# Altium schematic sheet 88LM Schematic.SchDoc: 8 x 8 Led Multiplexing
size A2; DrawnBy: Zachary Welch; Organization: M5 Makerspace; Revision: 01; SheetNumber: 1; SheetTotal: 1; M5TCID: M5TC-2021-88LM-0A(01); Version: 01; SheetSize: A2; Status: WIP; Designer1: Zachary Welch; Reviewer1: N/A; year: 2021; abbrev: 88LM; URL: N/A; Variant: A; CustomDate: 06 JUNE 2021; Designer2: N/A; Designer3: N/A; Reviewer2: N/A; Reviewer3: N/A
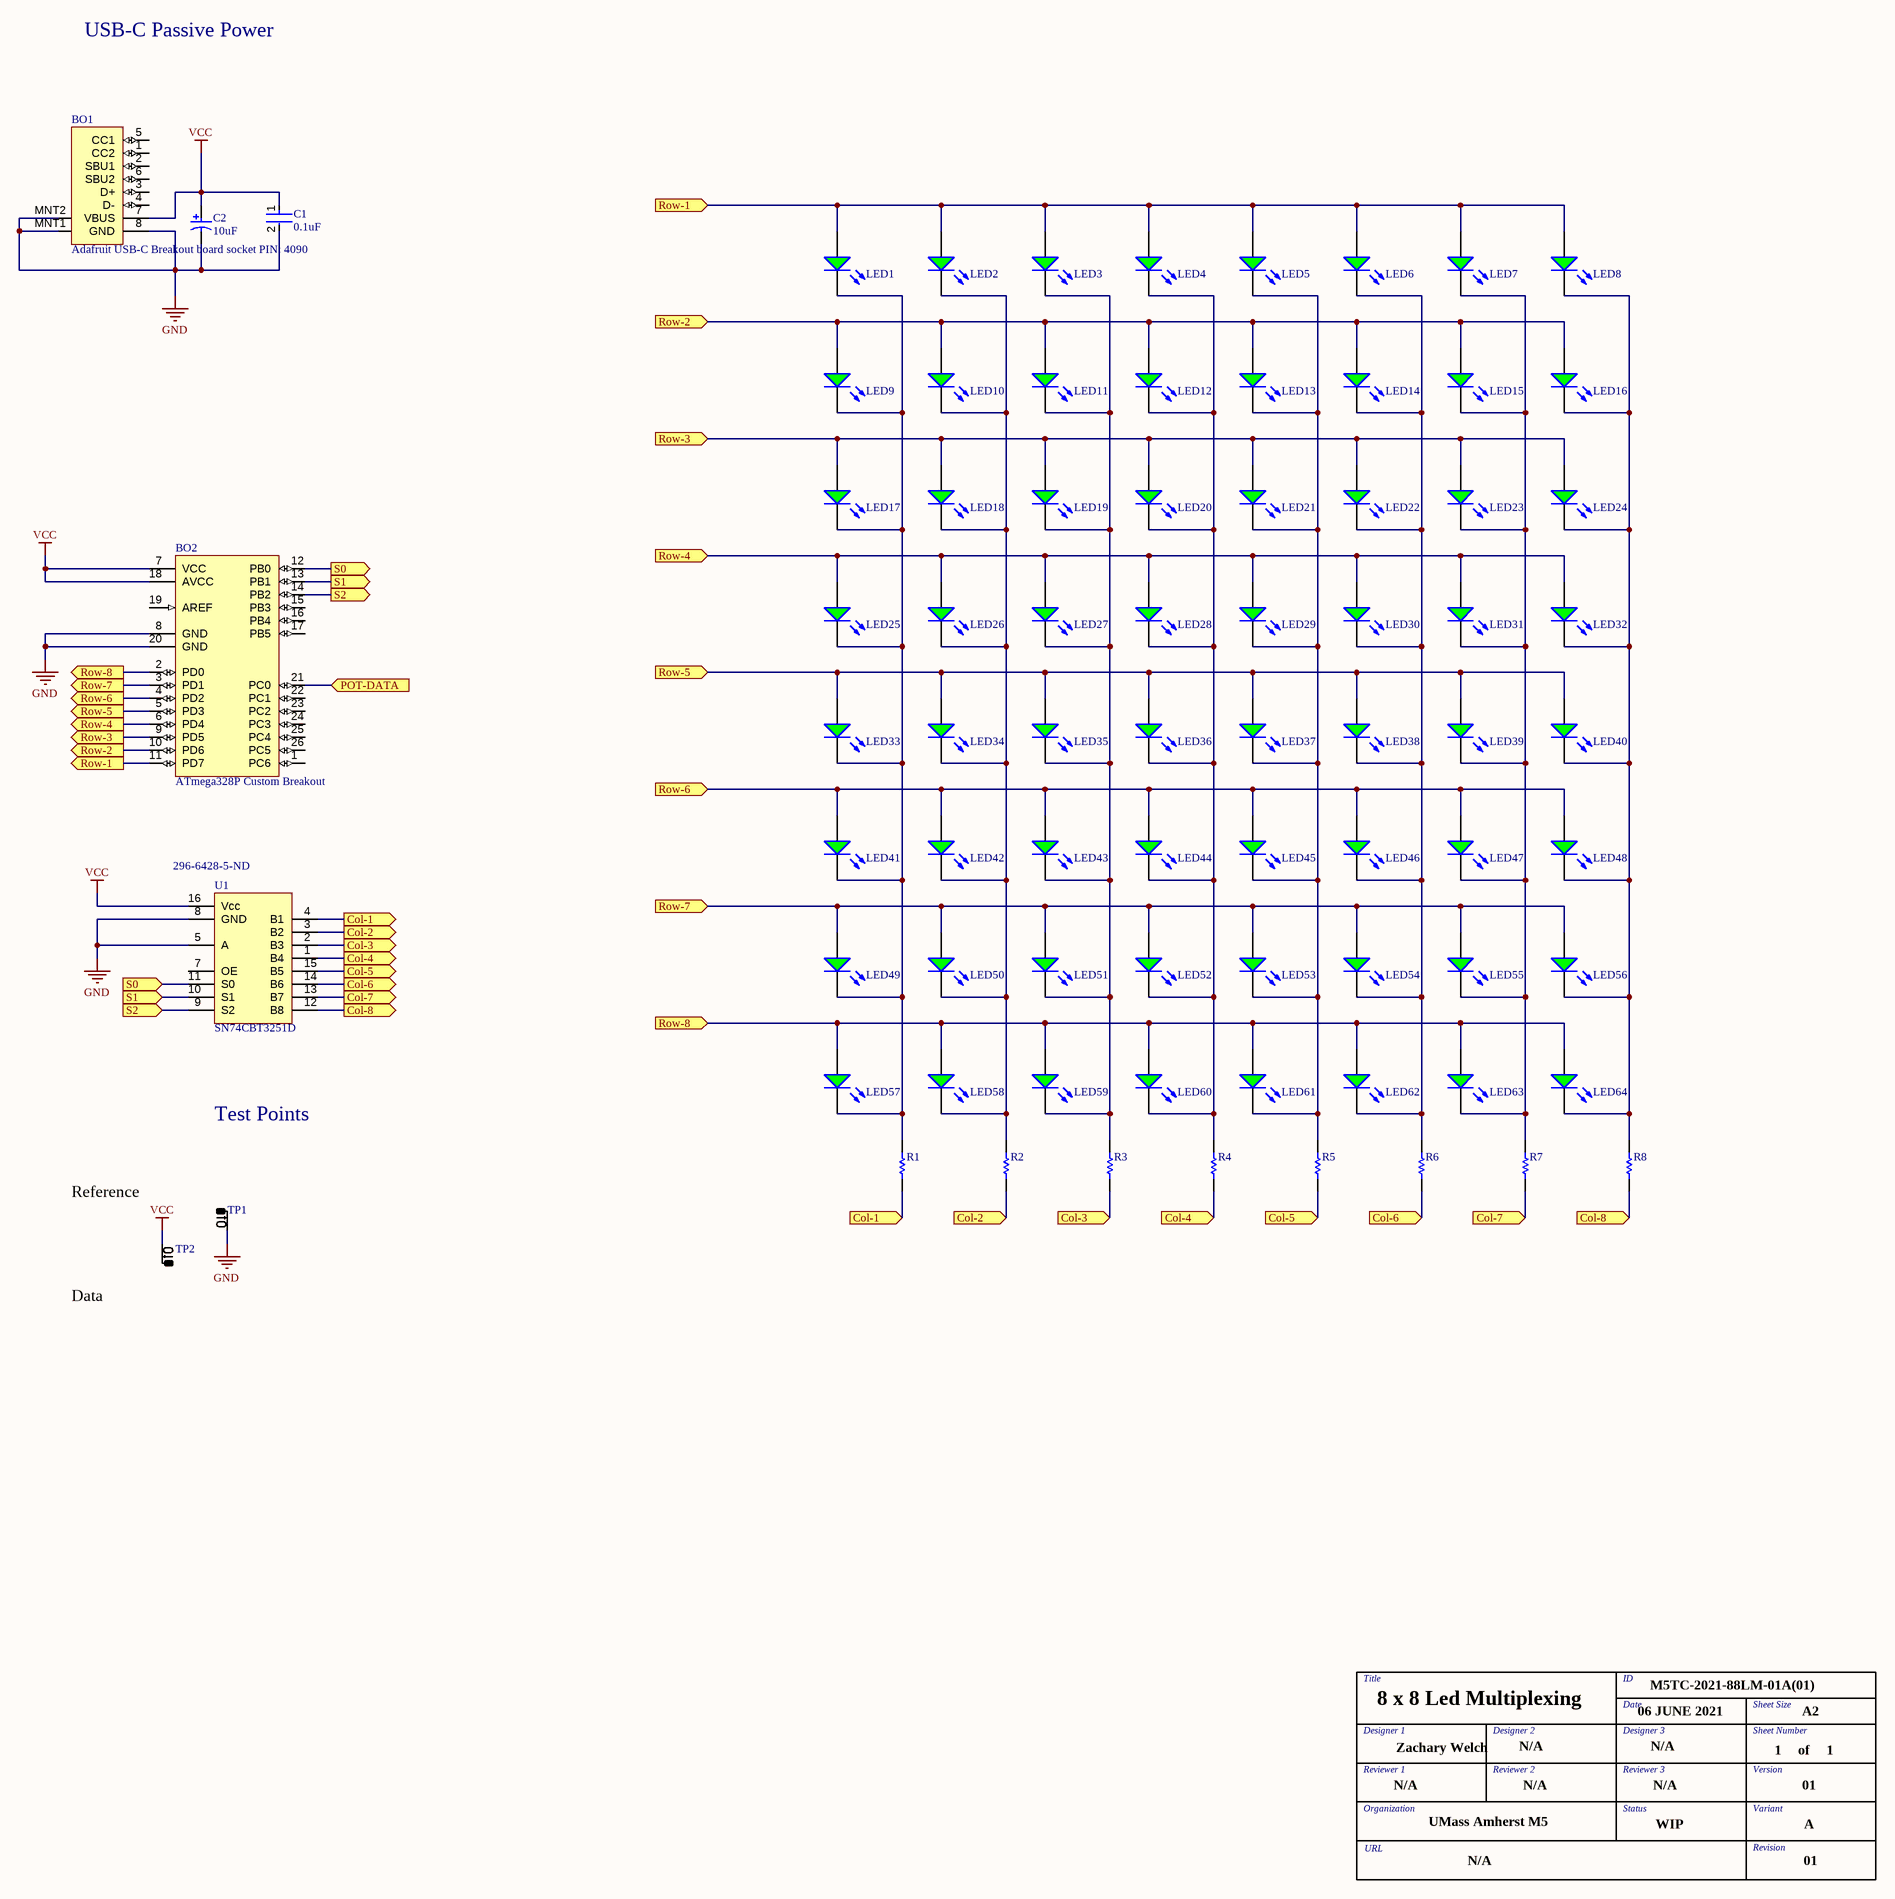
[diagram p0: 88LM Schematic.SchDoc]

## Parts
BO1  Adafruit USB-C Breakout board socket PIN: 4090  [Adafruit USB-C Breakout]
BO2  ATmega328P Custom Breakout  [328P-BOB]
C1  0.1uF  [FP-C0603-CJ-MFG]
C2  10uF  [KEMT-A-3216-18-2_M]
LED1  HLMP-4740  [AVAG-HLMP-4740]  (value not drawn)
LED2  HLMP-4740  [AVAG-HLMP-4740]  (value not drawn)
LED3  HLMP-4740  [AVAG-HLMP-4740]  (value not drawn)
LED4  HLMP-4740  [AVAG-HLMP-4740]  (value not drawn)
LED5  HLMP-4740  [AVAG-HLMP-4740]  (value not drawn)
LED6  HLMP-4740  [AVAG-HLMP-4740]  (value not drawn)
LED7  HLMP-4740  [AVAG-HLMP-4740]  (value not drawn)
LED8  HLMP-4740  [AVAG-HLMP-4740]  (value not drawn)
LED9  HLMP-4740  [AVAG-HLMP-4740]  (value not drawn)
LED10  HLMP-4740  [AVAG-HLMP-4740]  (value not drawn)
LED11  HLMP-4740  [AVAG-HLMP-4740]  (value not drawn)
LED12  HLMP-4740  [AVAG-HLMP-4740]  (value not drawn)
LED13  HLMP-4740  [AVAG-HLMP-4740]  (value not drawn)
LED14  HLMP-4740  [AVAG-HLMP-4740]  (value not drawn)
LED15  HLMP-4740  [AVAG-HLMP-4740]  (value not drawn)
LED16  HLMP-4740  [AVAG-HLMP-4740]  (value not drawn)
LED17  HLMP-4740  [AVAG-HLMP-4740]  (value not drawn)
LED18  HLMP-4740  [AVAG-HLMP-4740]  (value not drawn)
LED19  HLMP-4740  [AVAG-HLMP-4740]  (value not drawn)
LED20  HLMP-4740  [AVAG-HLMP-4740]  (value not drawn)
LED21  HLMP-4740  [AVAG-HLMP-4740]  (value not drawn)
LED22  HLMP-4740  [AVAG-HLMP-4740]  (value not drawn)
LED23  HLMP-4740  [AVAG-HLMP-4740]  (value not drawn)
LED24  HLMP-4740  [AVAG-HLMP-4740]  (value not drawn)
LED25  HLMP-4740  [AVAG-HLMP-4740]  (value not drawn)
LED26  HLMP-4740  [AVAG-HLMP-4740]  (value not drawn)
LED27  HLMP-4740  [AVAG-HLMP-4740]  (value not drawn)
LED28  HLMP-4740  [AVAG-HLMP-4740]  (value not drawn)
LED29  HLMP-4740  [AVAG-HLMP-4740]  (value not drawn)
LED30  HLMP-4740  [AVAG-HLMP-4740]  (value not drawn)
LED31  HLMP-4740  [AVAG-HLMP-4740]  (value not drawn)
LED32  HLMP-4740  [AVAG-HLMP-4740]  (value not drawn)
LED33  HLMP-4740  [AVAG-HLMP-4740]  (value not drawn)
LED34  HLMP-4740  [AVAG-HLMP-4740]  (value not drawn)
LED35  HLMP-4740  [AVAG-HLMP-4740]  (value not drawn)
LED36  HLMP-4740  [AVAG-HLMP-4740]  (value not drawn)
LED37  HLMP-4740  [AVAG-HLMP-4740]  (value not drawn)
LED38  HLMP-4740  [AVAG-HLMP-4740]  (value not drawn)
LED39  HLMP-4740  [AVAG-HLMP-4740]  (value not drawn)
LED40  HLMP-4740  [AVAG-HLMP-4740]  (value not drawn)
LED41  HLMP-4740  [AVAG-HLMP-4740]  (value not drawn)
LED42  HLMP-4740  [AVAG-HLMP-4740]  (value not drawn)
LED43  HLMP-4740  [AVAG-HLMP-4740]  (value not drawn)
LED44  HLMP-4740  [AVAG-HLMP-4740]  (value not drawn)
LED45  HLMP-4740  [AVAG-HLMP-4740]  (value not drawn)
LED46  HLMP-4740  [AVAG-HLMP-4740]  (value not drawn)
LED47  HLMP-4740  [AVAG-HLMP-4740]  (value not drawn)
LED48  HLMP-4740  [AVAG-HLMP-4740]  (value not drawn)
LED49  HLMP-4740  [AVAG-HLMP-4740]  (value not drawn)
LED50  HLMP-4740  [AVAG-HLMP-4740]  (value not drawn)
LED51  HLMP-4740  [AVAG-HLMP-4740]  (value not drawn)
LED52  HLMP-4740  [AVAG-HLMP-4740]  (value not drawn)
LED53  HLMP-4740  [AVAG-HLMP-4740]  (value not drawn)
LED54  HLMP-4740  [AVAG-HLMP-4740]  (value not drawn)
LED55  HLMP-4740  [AVAG-HLMP-4740]  (value not drawn)
LED56  HLMP-4740  [AVAG-HLMP-4740]  (value not drawn)
LED57  HLMP-4740  [AVAG-HLMP-4740]  (value not drawn)
LED58  HLMP-4740  [AVAG-HLMP-4740]  (value not drawn)
LED59  HLMP-4740  [AVAG-HLMP-4740]  (value not drawn)
LED60  HLMP-4740  [AVAG-HLMP-4740]  (value not drawn)
LED61  HLMP-4740  [AVAG-HLMP-4740]  (value not drawn)
LED62  HLMP-4740  [AVAG-HLMP-4740]  (value not drawn)
LED63  HLMP-4740  [AVAG-HLMP-4740]  (value not drawn)
LED64  HLMP-4740  [AVAG-HLMP-4740]  (value not drawn)
R1  ERJ-6GEYJ201V  [RESC2013X70X40ML20T20]  (value not drawn)
R2  ERJ-6GEYJ201V  [RESC2013X70X40ML20T20]  (value not drawn)
R3  ERJ-6GEYJ201V  [RESC2013X70X40ML20T20]  (value not drawn)
R4  ERJ-6GEYJ201V  [RESC2013X70X40ML20T20]  (value not drawn)
R5  ERJ-6GEYJ201V  [RESC2013X70X40ML20T20]  (value not drawn)
R6  ERJ-6GEYJ201V  [RESC2013X70X40ML20T20]  (value not drawn)
R7  ERJ-6GEYJ201V  [RESC2013X70X40ML20T20]  (value not drawn)
R8  ERJ-6GEYJ201V  [RESC2013X70X40ML20T20]  (value not drawn)
Tb  Title Block  (value not drawn)
TP1  Loop post and pad test point  [TEST POINT (LOOP/POST/PAD)]  (value not drawn)
TP2  Loop post and pad test point  [TEST POINT (LOOP/POST/PAD)]  (value not drawn)
U1  SN74CBT3251D  Supplier Part Number 1: 296-6428-5-ND  [SOIC127P600X175-16N]

## Ports
Col-1 (in), Col-1 (out), Col-2 (in), Col-2 (out), Col-3 (in), Col-3 (out), Col-4 (in), Col-4 (out), Col-5 (in), Col-5 (out), Col-6 (in), Col-6 (out), Col-7 (in), Col-7 (out), Col-8 (in), Col-8 (out), POT-DATA (in), Row-1 (in), Row-1 (out), Row-2 (in), Row-2 (out), Row-3 (in), Row-3 (out), Row-4 (in), Row-4 (out), Row-5 (in), Row-5 (out), Row-6 (in), Row-6 (out), Row-7 (in), Row-7 (out), Row-8 (in), Row-8 (out), S0 (in), S0 (out), S1 (in), S1 (out), S2 (in), S2 (out)

## Nets
GND: BO1.8(GND) BO1.MNT1 BO1.MNT2 BO2.8(GND) BO2.20(GND) C1.2 C2.2 TP1.1 U1.5(A) U1.8(GND)
VCC: BO1.7(VBUS) BO2.7(VCC) BO2.18(AVCC) C1.1 C2.1 TP2.1 U1.16(Vcc)
Col-1: R1.1 U1.4(B1) ; port Col-1
Col-2: R2.1 U1.3(B2) ; port Col-2
Col-3: R3.1 U1.2(B3) ; port Col-3
Col-4: R4.1 U1.1(B4) ; port Col-4
Col-5: R5.1 U1.15(B5) ; port Col-5
Col-6: R6.1 U1.14(B6) ; port Col-6
Col-7: R7.1 U1.13(B7) ; port Col-7
Col-8: R8.1 U1.12(B8) ; port Col-8
POT-DATA: BO2.21(PC0) ; port POT-DATA
Row-1: BO2.11(PD7) LED1.1(A) LED2.1(A) LED3.1(A) LED4.1(A) LED5.1(A) LED6.1(A) LED7.1(A) LED8.1(A) ; port Row-1
Row-2: BO2.10(PD6) LED9.1(A) LED10.1(A) LED11.1(A) LED12.1(A) LED13.1(A) LED14.1(A) LED15.1(A) LED16.1(A) ; port Row-2
Row-3: BO2.9(PD5) LED17.1(A) LED18.1(A) LED19.1(A) LED20.1(A) LED21.1(A) LED22.1(A) LED23.1(A) LED24.1(A) ; port Row-3
Row-4: BO2.6(PD4) LED25.1(A) LED26.1(A) LED27.1(A) LED28.1(A) LED29.1(A) LED30.1(A) LED31.1(A) LED32.1(A) ; port Row-4
Row-5: BO2.5(PD3) LED33.1(A) LED34.1(A) LED35.1(A) LED36.1(A) LED37.1(A) LED38.1(A) LED39.1(A) LED40.1(A) ; port Row-5
Row-6: BO2.4(PD2) LED41.1(A) LED42.1(A) LED43.1(A) LED44.1(A) LED45.1(A) LED46.1(A) LED47.1(A) LED48.1(A) ; port Row-6
Row-7: BO2.3(PD1) LED49.1(A) LED50.1(A) LED51.1(A) LED52.1(A) LED53.1(A) LED54.1(A) LED55.1(A) LED56.1(A) ; port Row-7
Row-8: BO2.2(PD0) LED57.1(A) LED58.1(A) LED59.1(A) LED60.1(A) LED61.1(A) LED62.1(A) LED63.1(A) LED64.1(A) ; port Row-8
S0: BO2.12(PB0) U1.11(S0) ; port S0
S1: BO2.13(PB1) U1.10(S1) ; port S1
S2: BO2.14(PB2) U1.9(S2) ; port S2
NetLED1_2: LED1.2(K) LED9.2(K) LED17.2(K) LED25.2(K) LED33.2(K) LED41.2(K) LED49.2(K) LED57.2(K) R1.2
NetLED2_2: LED2.2(K) LED10.2(K) LED18.2(K) LED26.2(K) LED34.2(K) LED42.2(K) LED50.2(K) LED58.2(K) R2.2
NetLED3_2: LED3.2(K) LED11.2(K) LED19.2(K) LED27.2(K) LED35.2(K) LED43.2(K) LED51.2(K) LED59.2(K) R3.2
NetLED4_2: LED4.2(K) LED12.2(K) LED20.2(K) LED28.2(K) LED36.2(K) LED44.2(K) LED52.2(K) LED60.2(K) R4.2
NetLED5_2: LED5.2(K) LED13.2(K) LED21.2(K) LED29.2(K) LED37.2(K) LED45.2(K) LED53.2(K) LED61.2(K) R5.2
NetLED6_2: LED6.2(K) LED14.2(K) LED22.2(K) LED30.2(K) LED38.2(K) LED46.2(K) LED54.2(K) LED62.2(K) R6.2
NetLED7_2: LED7.2(K) LED15.2(K) LED23.2(K) LED31.2(K) LED39.2(K) LED47.2(K) LED55.2(K) LED63.2(K) R7.2
NetLED8_2: LED8.2(K) LED16.2(K) LED24.2(K) LED32.2(K) LED40.2(K) LED48.2(K) LED56.2(K) LED64.2(K) R8.2

Not connected (* = marked no-connect by the designer): BO1 1(CC2) 2(SBU1) 3(D+) 4(D-) 5(CC1) 6(SBU2); BO2 1(PC6) 15(PB3) 16(PB4) 17(PB5) 19(AREF) 22(PC1) 23(PC2) 24(PC3) 25(PC4) 26(PC5); U1 7(OE)

## Notes on the sheet
- USB-C Passive Power
- Test Points
- Reference
- Data
- (in symbol Title Block) Title; ID; Date; Sheet Size; Designer 1; Designer 2; Designer 3; Sheet Number; of; Reviewer 1; Reviewer 2; Reviewer 3; Version; Organization; Status; Variant; UMass Amherst M5; URL; Revision

## Library data of the parts
BO1 = Adafruit USB-C Breakout: https://www.adafruit.com/product/4090; ComponentLink1Description: Adafruit; ComponentLink1URL: https://www.adafruit.com/product/4090
BO2 = 328P-BOB: Custom Breakout Board for 328P-PU
C1 = CMP-2006-03300-2: CAP CER 0.1UF 50V X7R 0603; Manufacturer Part Number: C0603X104K5RACTU; Manufacturer: Kemet; Capacitance: 100nF; Material: Ceramic; Tolerance: 10%; Value: 100nF; Temperature Coefficient: 15%; Temperature Range High: +125°C; Temperature Range Low: -55°C; Voltage: 50V; ComponentLink2Description: Datasheet; RoHS: TRUE; ComponentLink2URL: https://content.kemet.com/datasheets/KEM_C1013_X7R_FT-CAP_SMD.pdf; Device Class L3: Ceramic Capacitors; Device Class L2: Capacitors; Package: C0603-CJ; Height: 0.95mm; Device Class L1: Passive Components; Temperature Characteristic: X7R; Lead Free: Yes; Digikey Description: CAP CER 0.1UF 50V X7R 0603; Automotive: No; Mouser Description: Capacitor; Ceramic; Cap 0.1uF; Tol+10%; SMT; Flexible Termination; Vol-Rtg 50V; TR; Temperature: -55°C to +125°C; Octopart: https://octopart.com/c0603x104k5ractu-kemet-9145062; Category: Cap; Voltage Rating: 50V; Ipc Land Pattern Name: CAPC16080X80
C2 = CMP-2000-05172-1: Capacitor, Tantalum, 10 uF, +/- 10%, 10 V, -55 to 125 degC, 2-Pin SMD (1206), RoHS, Tape and Reel; Manufacturer Size Code: A; Manufacturer: Kemet; Type: Molded; Online Catalog: T491Series; Other Names: 399-3684-2; Voltage - Rated: 10V; Lifetime @ Temp.: 2000Hrs@85degC; Product Training Modules: CapacitorBasics-TypicalUsesforCapacitorsDeratingGuidelinesforSurfaceMountTantalumCapacitors; ESR (Equivalent Series Resistance): 3.8Ohm; Capacitance: 10µF; Catalog Drawings: T49x,T5xxSeries_A-side1T49x,T5xxSeries_A,B-side2T49x,T5xxSeries_A,SBottom; Family: TantalumCapacitors; Manufacturer URL: http://www.kemet.com/; Datasheet URL: http://www.farnell.com/datasheets/1824869.pdf; Package Reference: 1206; Packaging: Tape&Reel(TR); Series: T491; Operating Temperature: -55degC~125degC; Mounting Type: SurfaceMount; Height - Seated (Max): 0.071"(1.80mm); Package / Case: 1206(3216Metric); Package Description: 2-Pin Surface Mount Device, Body 3.2 x 1.6 mm; Features: GeneralPurpose; Tolerance: ±10%; Lead Spacing: -; Size / Dimension: 0.126"Lx0.063"W(3.20mmx1.60mm); Standard Package: 2,000; Datasheet Version: Apr-14; Category: Capacitors
LED1-LED64 = CMP-2000-06413-1: T-1 3/4 (5 mm) Low Current LED Lamp, Green, 1.9 V, -20 to 100 degC, 2-Pin THD, RoHS, Bulk; Manufacturer: AvagoTechnologies; Type: Uni-Color; Peak Wavelength: 565nm; Rad Hard: No; Viewing Angle: 50°; Dominant Wavelength/Color Temperature: 569nm; Number of LEDs: 1; Lens Appearance: ColoredDiffused; Lens Shape Type: Circular; Mounting Orientation: TopMount; Intensity: 2.3mcd; Datasheet Version: 07/2014; Category: LEDs; Datasheet URL: http://docs.avagotech.com/docs/AV02-1557EN; Packaging: Bulk; Pin Count: 2; Mounting Technology: ThroughHole; Package Reference: HLMP-4740; Mounting: ThroughHole; Manufacturer URL: http://www.avagotech.com/; Color: Green; Package: 2T-13/4; Package Description: 2-Pin Through Hole Device, Dia 5.845 mm, Pitch 2.54 mm
R1-R8 = CMP-2001-00369-1: Manufacturer: Panasonic; Part Number: ERJ-6GEYJ201V
TP1 TP2 = Test Point (Loop/Post/Pad): Requires 1 Keystone Electronics PC Test Point Multipurpose (see 5011 for example); Supplier 1: Digi-Key; Supplier Part Number 1: 36-5011-ND
U1 = SN74CBT3251D: Supplier 1: Digi-Key